# EAGLE design linea base (EAGLE 9.6.2)
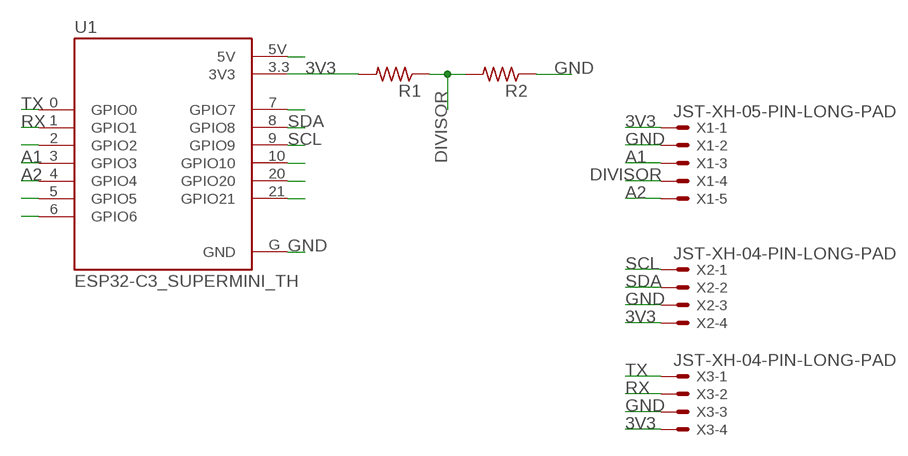
[diagram p0: schematic, sheet 1]

## Parts
R1  R-US_0204/7  [0204/7]
R2  R-US_0204/7  [0204/7]
U1  ESP32-C3_SUPERMINI_TH  [MODULE_ESP32-C3_SUPERMINI_TH]
X1  JST-XH-05-PIN-LONG-PAD  [JST-XH-05-PACKAGE-LONG-PAD]
X2  JST-XH-04-PIN-LONG-PAD  [JST-XH-04-PACKAGE-LONG-PAD]
X3  JST-XH-04-PIN-LONG-PAD  [JST-XH-04-PACKAGE-LONG-PAD]

## Nets
3V3: R1.2 U1.3.3(3V3) X1.1 X2.4 X3.4
A1: U1.3(GPIO3) X1.3
A2: U1.4(GPIO4) X1.5
DIVISOR: R1.1 R2.2 X1.4
GND: R2.1 U1.G(GND) X1.2 X2.3 X3.3
N$3: U1.2(GPIO2)
N$6: U1.5(GPIO5)
N$7: U1.6(GPIO6)
N$8: U1.5V
N$10: U1.7(GPIO7)
N$13: U1.10(GPIO10)
N$14: U1.20(GPIO20)
N$15: U1.21(GPIO21)
RX: U1.1(GPIO1) X3.2
SCL: U1.9(GPIO9) X2.1
SDA: U1.8(GPIO8) X2.2
TX: U1.0(GPIO0) X3.1

## Library data of the parts
R1 R2 = rcl:R-US_: RESISTOR, American symbol; SPICEPREFIX: R
U1 = ESP32-C3_SUPERMINI_TH:ESP32-C3_SUPERMINI_TH: Check availability <https://pricing.snapeda.com/parts/ESP32-C3%20SuperMini_TH/Espressif%20Systems/view-part?ref=eda>; AVAILABILITY: Not in stock; CHECK_PRICES: https://www.snapeda.com/parts/ESP32-C3%20SuperMini_TH/Espressif+Systems/view-part/?ref=eda; DESCRIPTION: Super tiny ESP32-C3 board; MF: Espressif Systems; MP: ESP32-C3 SuperMini_TH; PACKAGE: Package; PRICE: None; SNAPEDA_LINK: https://www.snapeda.com/parts/ESP32-C3%20SuperMini_TH/Espressif+Systems/view-part/?ref=snap
X1 = Rembrandt Electronics - JST XH Connectors v1-0:JST-XH-05-PIN: JST XH Connector 2 Pin Wire to board connector. Pitch: 2,54 mm, (0.100") Number of pins: 5 Created by Rembrandt Electronics www.rembrandtelectronics.com
X2 X3 = Rembrandt Electronics - JST XH Connectors v1-0:JST-XH-04-PIN: JST XH Connector 2 Pin Wire to board connector. Pitch: 2,54 mm, (0.100") Number of pins: 4 Created by Rembrandt Electronics www.rembrandtelectronics.com

## Board
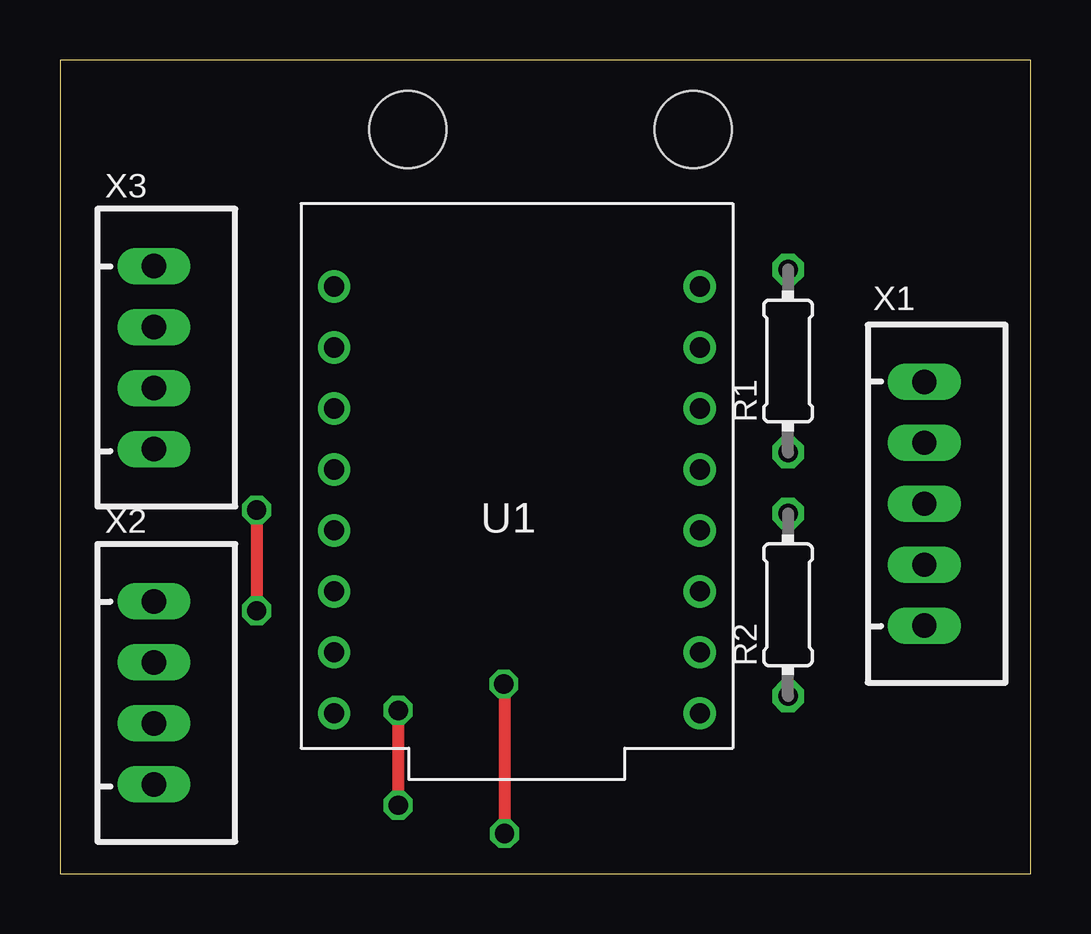
[diagram p1: board, top side]
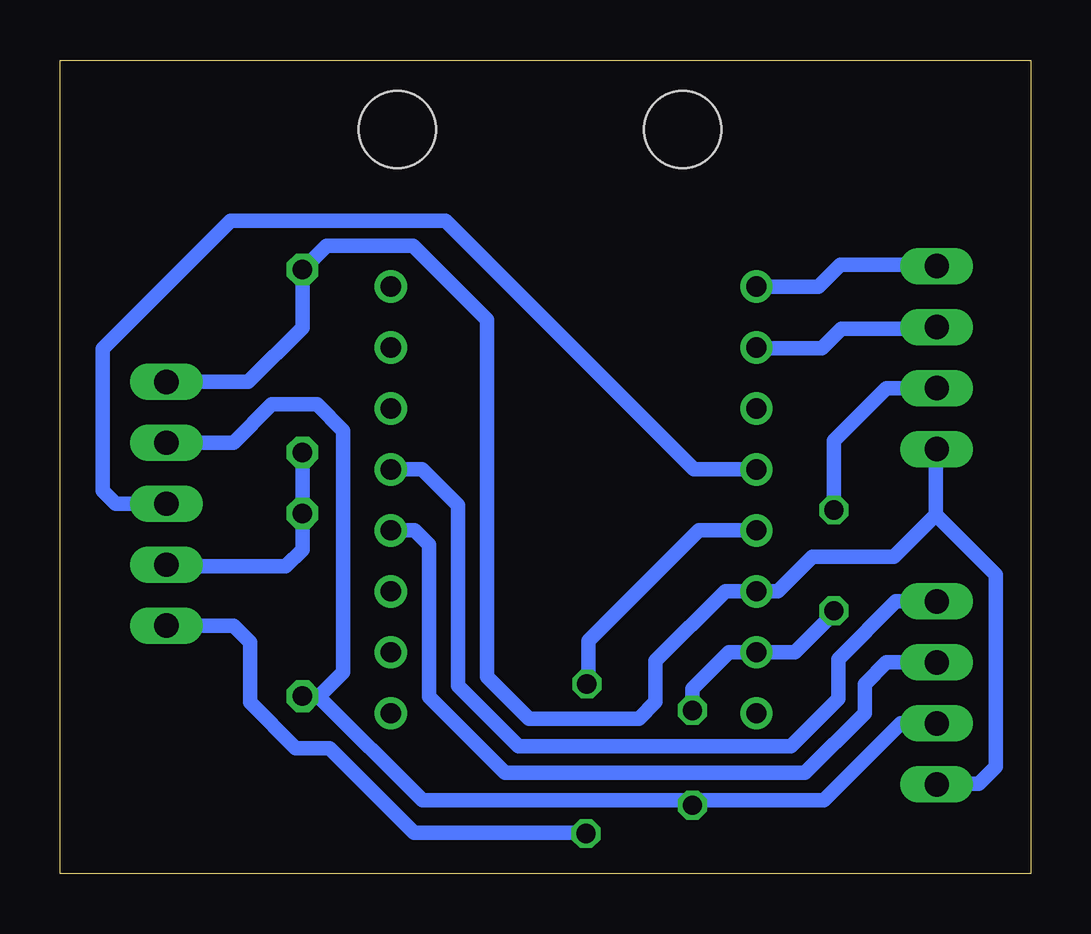
[diagram p2: board, bottom side, seen from below]

Size 40.46 x 33.9 mm. Coordinates in mm from the lower left corner, seen from the top.
Outline: 0,0 40.46,0 40.46,33.9 0,33.9 0,0
Copper layers (1*16): Top 0.035mm / dielectric 1.5mm / Bottom 0.035mm
Design rules "default *": minimum track width 0.5mm, minimum drill 0.35mm, track to track 0.4mm, track to pad 0.4mm, pad to pad 0.4mm, via to via 0.4mm, smd to smd 6mil, copper to edge 40mil, drill to drill 6mil, minimum pad ring 10mil, minimum via ring 8mil, stop-mask expansion 4mil, vias tented up to drill 0mil, thermal gap 10mil
Holes 3.2 mm at 14.5,31 26.4,31

### Footprints (pad centres in the part's own frame; a part is rotated, then mirrored left to right if it is on the bottom)
0204/7 = drill 0.813 octagon: 1 -3.81,0; 2 3.81,0
MODULE_ESP32-C3_SUPERMINI_TH = drill 0.84: 0 7.62,-7.88; 1 7.62,-5.34; 2 7.62,-2.8; 3 7.62,-0.26; 3.3 7.62,4.82; 4 7.62,2.28; 5 -7.62,9.9; 5V 7.62,9.9; 6 -7.62,7.36; 7 -7.62,4.82; 8 -7.62,2.28; 9 -7.62,-0.26; 10 -7.62,-2.8; 20 -7.62,-5.34; 21 -7.62,-7.88; G 7.62,7.36
JST-XH-05-PACKAGE-LONG-PAD = drill 1.016 long: 1 -5.08,0; 2 -2.54,0; 3 0,0; 4 2.54,0; 5 5.08,0
JST-XH-04-PACKAGE-LONG-PAD = drill 1.016 long: 1 -3.81,0; 2 -1.27,0; 3 1.27,0; 4 3.81,0

### Placement (x,y rotation side)
R1  30.35,21.36 90 top
R2  30.35,11.2 90 top
U1  19.05,16.58 180 top
X1  36.03,15.41 270 top
X2  3.91,7.53 270 top
X3  3.91,21.5 270 top

### Tracks (layer width: path | path; a pad name or v marks a point on that pad's centre or on a via)
3V3
  Bottom 0.61: X1.1 32.61,20.49 30.35,22.75 R1.2 29.35,26.17 25.75,26.17 22.65,23.07 22.65,8.2 20.91,6.46 16.33,6.46 15.63,7.16 15.63,8.86 12.73,11.76 U1.3.3 10.53,11.76 9.1,13.2 5.71,13.2 3.95,14.95 3.95,17.65 X3.4 | X2.4 3.7,3.75 2.15,3.75 1.45,4.45 1.45,12.45 3.85,14.85
A1
  Bottom 0.61: U1.3 11.61,16.84 11.62,16.85 14.04,16.85 24.39,27.2 33.35,27.2 38.68,21.87 38.68,15.96 38.13,15.41 X1.3
A2  (via drill 0.8)
  Top 0.5: v18.5,7.9 18.53,7.87 v18.53,1.67
  Bottom 0.61: U1.4 13.83,14.3 18.43,9.7 18.43,7.97 v18.5,7.9 | v18.53,1.67 18.56,1.7 25.7,1.7 29.23,5.23 30.63,5.23 32.53,7.13 32.53,9.63 33.23,10.33 X1.5
DIVISOR
  Bottom 0.61: R1.1 R2.2 30.35,13.5 31.05,12.8 35.97,12.8 X1.4
GND  (via drill 0.8)
  Top 0.5: X2.3 | v8.2,15.15 v8.2,10.95 | v14.1,6.8 v14.1,2.85
  Bottom 0.61: X1.2 33.23,17.95 31.63,19.55 29.75,19.55 28.65,18.45 28.65,8.39 29.65,7.39 R2.1 29.69,7.39 25.35,3.05 14.3,3.05 v14.1,2.85 13.9,3.05 8.62,3.05 5.41,6.26 X2.3 | v8.2,10.95 8.18,10.93 8.18,10.88 9.83,9.22 U1.G 12.58,9.22 14.1,7.7 v14.1,6.8 | X3.3 6.01,20.23 8.21,18.03 v8.21,15.16 v8.2,15.15
RX
  Bottom 0.61: U1.1 11.41,21.9 8.7,21.9 7.9,22.7 3.98,22.7 X3.2
SCL
  Bottom 0.61: U1.9 25.37,16.84 23.87,15.34 23.87,7.82 21.35,5.3 10,5.3 8.01,7.29 8.01,8.94 5.61,11.34 X2.1
SDA
  Bottom 0.61: U1.8 25.67,14.3 25.07,13.7 25.07,7.37 21.9,4.2 9.4,4.2 6.91,6.69 6.91,7.9 6.01,8.8 X2.2
TX
  Bottom 0.61: U1.0 8.85,24.46 7.94,25.38 3.98,25.38 X3.1